# Altium schematic sheet Sheet5.SchDoc
size A3; SheetNumber: 5; SheetTotal: 6
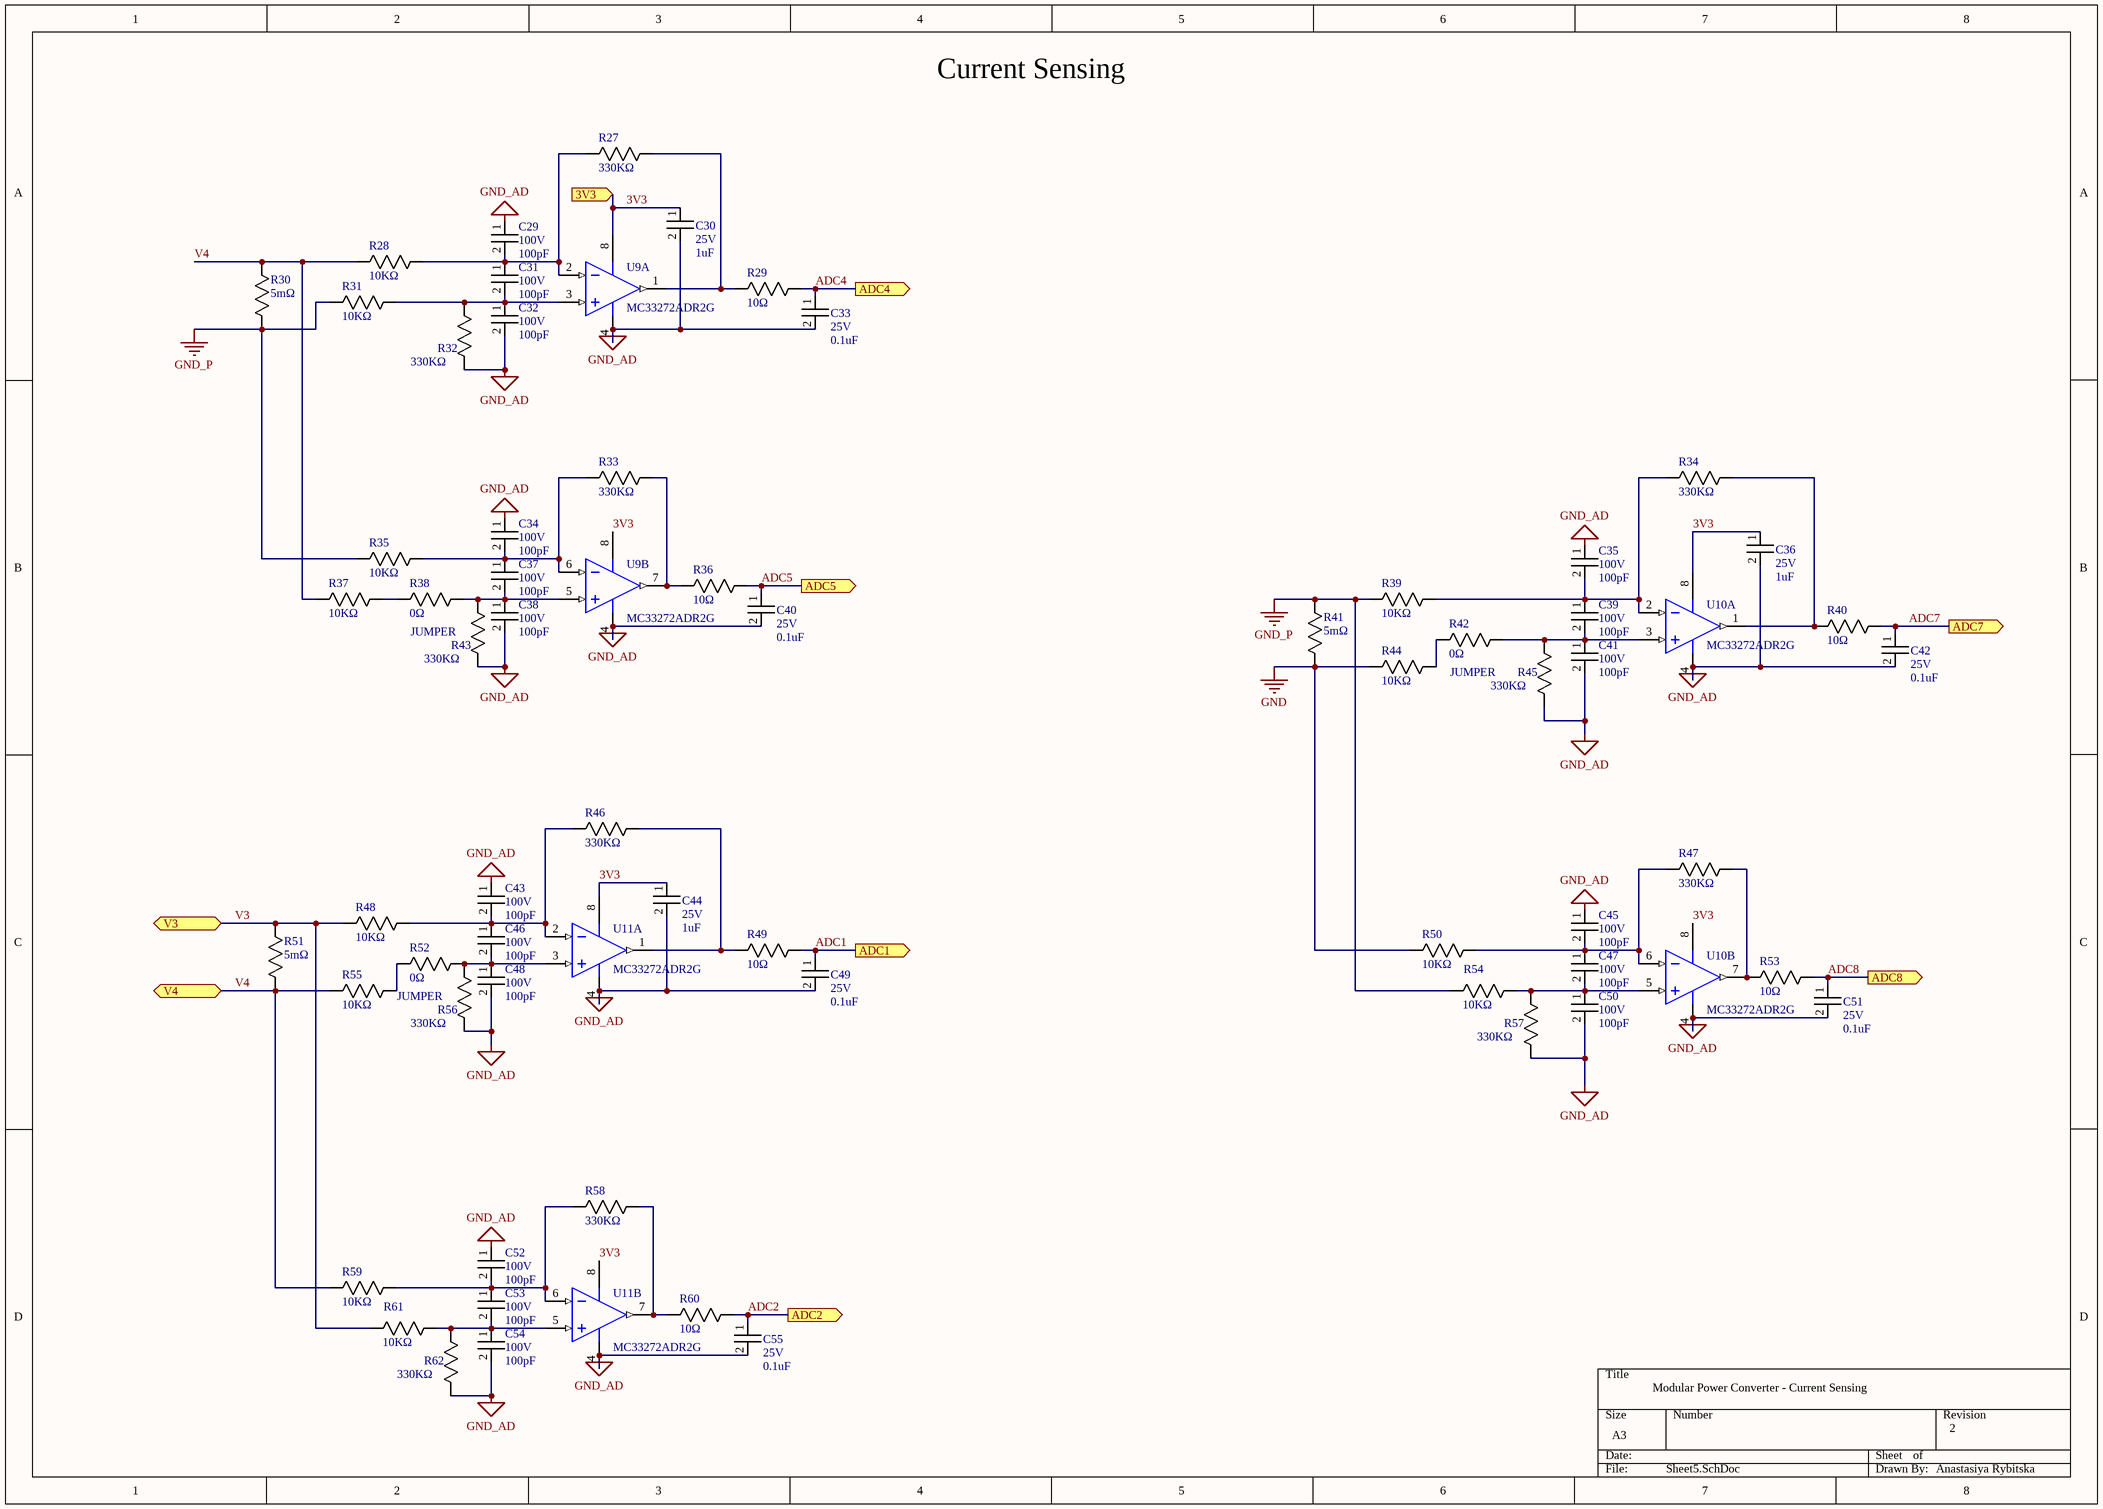
[diagram p0: Sheet5.SchDoc]

## Parts
C29  Voltage Rating: 100V  Capacitance: 100pF  [0603]  (hidden comment: 06031C101KAT2A)
C30  Voltage Rating: 25V  Capacitance: 1uF  [0603]  (hidden comment: CL10B105KA8NFNC)
C31  Voltage Rating: 100V  Capacitance: 100pF  [0603]  (hidden comment: 06031C101KAT2A)
C32  Voltage Rating: 100V  Capacitance: 100pF  [0603]  (hidden comment: 06031C101KAT2A)
C33  Voltage Rating: 25V  Capacitance: 0.1uF  [0603]  (hidden comment: CC0603MRX7R8BB104)
C34  Voltage Rating: 100V  Capacitance: 100pF  [0603]  (hidden comment: 06031C101KAT2A)
C35  Voltage Rating: 100V  Capacitance: 100pF  [0603]  (hidden comment: 06031C101KAT2A)
C36  Voltage Rating: 25V  Capacitance: 1uF  [0603]  (hidden comment: CL10B105KA8NFNC)
C37  Voltage Rating: 100V  Capacitance: 100pF  [0603]  (hidden comment: 06031C101KAT2A)
C38  Voltage Rating: 100V  Capacitance: 100pF  [0603]  (hidden comment: 06031C101KAT2A)
C39  Voltage Rating: 100V  Capacitance: 100pF  [0603]  (hidden comment: 06031C101KAT2A)
C40  Voltage Rating: 25V  Capacitance: 0.1uF  [0603]  (hidden comment: CC0603MRX7R8BB104)
C41  Voltage Rating: 100V  Capacitance: 100pF  [0603]  (hidden comment: 06031C101KAT2A)
C42  Voltage Rating: 25V  Capacitance: 0.1uF  [0603]  (hidden comment: CC0603MRX7R8BB104)
C43  Voltage Rating: 100V  Capacitance: 100pF  [0603]  (hidden comment: 06031C101KAT2A)
C44  Voltage Rating: 25V  Capacitance: 1uF  [0603]  (hidden comment: CL10B105KA8NFNC)
C45  Voltage Rating: 100V  Capacitance: 100pF  [0603]  (hidden comment: 06031C101KAT2A)
C46  Voltage Rating: 100V  Capacitance: 100pF  [0603]  (hidden comment: 06031C101KAT2A)
C47  Voltage Rating: 100V  Capacitance: 100pF  [0603]  (hidden comment: 06031C101KAT2A)
C48  Voltage Rating: 100V  Capacitance: 100pF  [0603]  (hidden comment: 06031C101KAT2A)
C49  Voltage Rating: 25V  Capacitance: 0.1uF  [0603]  (hidden comment: CC0603MRX7R8BB104)
C50  Voltage Rating: 100V  Capacitance: 100pF  [0603]  (hidden comment: 06031C101KAT2A)
C51  Voltage Rating: 25V  Capacitance: 0.1uF  [0603]  (hidden comment: CC0603MRX7R8BB104)
C52  Voltage Rating: 100V  Capacitance: 100pF  [0603]  (hidden comment: 06031C101KAT2A)
C53  Voltage Rating: 100V  Capacitance: 100pF  [0603]  (hidden comment: 06031C101KAT2A)
C54  Voltage Rating: 100V  Capacitance: 100pF  [0603]  (hidden comment: 06031C101KAT2A)
C55  Voltage Rating: 25V  Capacitance: 0.1uF  [0603]  (hidden comment: CC0603MRX7R8BB104)
R27  Resistance: 330KΩ  [0603]  (hidden comment: ERJ3EKF3303V)
R28  Resistance: 10KΩ  [0603]  (hidden comment: RNCP0603FTD10K0)
R29  Resistance: 10Ω  [0603]  (hidden comment: RMCF0603JT10R0)
R30  Resistance: 5mΩ  [RES_LVT12_004-020_OHM]  (hidden comment: LVT12R0050FER)
R31  Resistance: 10KΩ  [0603]  (hidden comment: RNCP0603FTD10K0)
R32  Resistance: 330KΩ  [0603]  (hidden comment: ERJ3EKF3303V)
R33  Resistance: 330KΩ  [0603]  (hidden comment: ERJ3EKF3303V)
R34  Resistance: 330KΩ  [0603]  (hidden comment: ERJ3EKF3303V)
R35  Resistance: 10KΩ  [0603]  (hidden comment: RNCP0603FTD10K0)
R36  Resistance: 10Ω  [0603]  (hidden comment: RMCF0603JT10R0)
R37  Resistance: 10KΩ  [0603]  (hidden comment: RNCP0603FTD10K0)
R38  Resistance: 0Ω  [0603]  (hidden comment: AC0603FR-070RL)
R39  Resistance: 10KΩ  [0603]  (hidden comment: RNCP0603FTD10K0)
R40  Resistance: 10Ω  [0603]  (hidden comment: RMCF0603JT10R0)
R41  Resistance: 5mΩ  [RES_LVT12_004-020_OHM]  (hidden comment: LVT12R0050FER)
R42  Resistance: 0Ω  [0603]  (hidden comment: AC0603FR-070RL)
R43  Resistance: 330KΩ  [0603]  (hidden comment: ERJ3EKF3303V)
R44  Resistance: 10KΩ  [0603]  (hidden comment: RNCP0603FTD10K0)
R45  Resistance: 330KΩ  [0603]  (hidden comment: ERJ3EKF3303V)
R46  Resistance: 330KΩ  [0603]  (hidden comment: ERJ3EKF3303V)
R47  Resistance: 330KΩ  [0603]  (hidden comment: ERJ3EKF3303V)
R48  Resistance: 10KΩ  [0603]  (hidden comment: RNCP0603FTD10K0)
R49  Resistance: 10Ω  [0603]  (hidden comment: RMCF0603JT10R0)
R50  Resistance: 10KΩ  [0603]  (hidden comment: RNCP0603FTD10K0)
R51  Resistance: 5mΩ  [RES_LVT12_004-020_OHM]  (hidden comment: LVT12R0050FER)
R52  Resistance: 0Ω  [0603]  (hidden comment: AC0603FR-070RL)
R53  Resistance: 10Ω  [0603]  (hidden comment: RMCF0603JT10R0)
R54  Resistance: 10KΩ  [0603]  (hidden comment: RNCP0603FTD10K0)
R55  Resistance: 10KΩ  [0603]  (hidden comment: RNCP0603FTD10K0)
R56  Resistance: 330KΩ  [0603]  (hidden comment: ERJ3EKF3303V)
R57  Resistance: 330KΩ  [0603]  (hidden comment: ERJ3EKF3303V)
R58  Resistance: 330KΩ  [0603]  (hidden comment: ERJ3EKF3303V)
R59  Resistance: 10KΩ  [0603]  (hidden comment: RNCP0603FTD10K0)
R60  Resistance: 10Ω  [0603]  (hidden comment: RMCF0603JT10R0)
R61  Resistance: 10KΩ  [0603]  (hidden comment: RNCP0603FTD10K0)
R62  Resistance: 330KΩ  [0603]  (hidden comment: ERJ3EKF3303V)
U9  MC33272ADR2G  [ONSC-SOIC-8-751-07_V]  (parts A,B of 2)
U10  MC33272ADR2G  [ONSC-SOIC-8-751-07_V]  (parts A,B of 2)
U11  MC33272ADR2G  [ONSC-SOIC-8-751-07_V]  (parts A,B of 2)

## Ports
3V3 (in), ADC1 (out), ADC2 (out), ADC4 (out), ADC5 (out), ADC7 (out), ADC8 (out), V3 (bidir), V4 (bidir)

## Nets
GND: R41.1 R44.1 R50.1
GND_AD: C29.1 C30.2 C32.2 C33.2 C34.1 C35.1 C36.2 C38.2 C40.2 C41.2 C42.2 C43.1 C44.2 C45.1 C48.2 C49.2 C50.2 C51.2 C52.1 C54.2 C55.2 R32.1 R43.1 R45.1 R56.1 R57.1 R62.1 U9.4(VEE) U10.4(VEE) U11.4(VEE)
GND_P: R30.1 R31.1 R35.1 R39.1 R41.2 R54.1
3V3: C30.1 C36.1 C44.1 U9.8(VCC) U10.8(VCC) U11.8(VCC) ; port 3V3
ADC1: C49.1 R49.2 ; port ADC1
ADC2: C55.1 R60.2 ; port ADC2
ADC4: C33.1 R29.2 ; port ADC4
ADC5: C40.1 R36.2 ; port ADC5
ADC7: C42.1 R40.2 ; port ADC7
ADC8: C51.1 R53.2 ; port ADC8
V3: R48.1 R51.2 R61.1 ; port V3
V4: R28.1 R30.2 R37.1 R51.1 R55.1 R59.1 ; port V4
NetC29_2: C29.2 C31.1 R27.1 R28.2 U9.2(IN1-)
NetC31_2: C31.2 C32.1 R31.2 R32.2 U9.3(IN1+)
NetC34_2: C34.2 C37.1 R33.1 R35.2 U9.6(IN2-)
NetC35_2: C35.2 C39.1 R34.1 R39.2 U10.2(IN1-)
NetC37_2: C37.2 C38.1 R38.2 R43.2 U9.5(IN2+)
NetC39_2: C39.2 C41.1 R42.2 R45.2 U10.3(IN1+)
NetC43_2: C43.2 C46.1 R46.1 R48.2 U11.2(IN1-)
NetC45_2: C45.2 C47.1 R47.1 R50.2 U10.6(IN2-)
NetC46_2: C46.2 C48.1 R52.2 R56.2 U11.3(IN1+)
NetC47_2: C47.2 C50.1 R54.2 R57.2 U10.5(IN2+)
NetC52_2: C52.2 C53.1 R58.1 R59.2 U11.6(IN2-)
NetC53_2: C53.2 C54.1 R61.2 R62.2 U11.5(IN2+)
NetR27_2: R27.2 R29.1 U9.1(OUT1)
NetR33_2: R33.2 R36.1 U9.7(OUT2)
NetR34_2: R34.2 R40.1 U10.1(OUT1)
NetR37_2: R37.2 R38.1
NetR42_1: R42.1 R44.2
NetR46_2: R46.2 R49.1 U11.1(OUT1)
NetR47_2: R47.2 R53.1 U10.7(OUT2)
NetR52_1: R52.1 R55.2
NetR58_2: R58.2 R60.1 U11.7(OUT2)

## Notes on the sheet
- Current Sensing
- JUMPER
- (near R55) JUMPER
- Modular Power Converter - Current Sensing
- 2
- Anastasiya Rybitska

## Library data of the parts
C30 C36 C44 = CL10B105KA8NFNC: Cap Ceramic 1uF 25V X7R ±10% Pad SMD 0603 +125°C T/R
C33 C40 C42 C49 C51 C55 = CC0603MRX7R8BB104: CAP CER 0.1UF 25V X7R 0603
R28 R31 R35 R37 R39 R44 R48 R50 R54 R55 R59 R61 = RNCP0603FTD10K0: 10kΩ ±1% 0.125W 0603 High Power Anti-Sulfur Thin Film Chip Resistor
R29 R36 R40 R49 R53 R60 = RMCF0603JT10R0: RES 10 OHM 5% 1/10W 0603
R30 R41 R51 = LVT12R0050FER: No Description Available; Mfr_Name: Ohmite; Copyright: Copyright (C) 2022 Ultra Librarian. All rights reserved.; Manufacturer_Part_Number: LVT12R0050FER; Digi-Key_Part_Number_1: LVT12R0050FERTR-ND; Digi-Key_Part_Number_2: LVT12R0050FERCT-ND; Digi-Key_Part_Number_3: LVT12R0050FERDKR-ND; RefDes: RefDes; Type: DEV
R38 R42 R52 = AC0603FR-070RL: RES SMD 0 OHM JUMPER 1/10W 0603
U9-U11 = CMP-1310-00346-1: Single Supply, High Slew Rate, Low Input Offset Voltage Operational Amplifier, 3 to 36 V, -40 to 85 degC, 8-Pin SOIC, Pb-Free, Tape and Reel; Manufacturer: On Semiconductor; VCC Min (V): 3; SR Typ (V/uS): 10; GBW Typ (MHz): 24; VCC Max (V): 36; ComponentLink2Description: Datasheet; Mounting Technology: Surface Mount; PackageDescription: 8-Pin Small Outline Integrated Circuit, Body 4.9 x 3.9 mm, Pitch 1.27 mm; ComponentLink1URL: http://www.onsemi.com/; PartNumber: MC33272ADR2G; Packing: Tape and Reel; RoHS: TRUE; ComponentLink2URL: http://www.onsemi.cn/pub_link/Collateral/MC33272A-D.PDF; DatasheetVersion: Rev. 14; ComponentLink3Description: Package Specification; ComponentLink3URL: http://www.onsemi.com/pub_link/Collateral/751-07.PDF; ComponentLink1Description: Manufacturer URL; PackageReference: SOIC-8-751-07; PackageVersion: Rev. AK, 02/2011